# EAGLE design sensor_unitv3 (EAGLE 7.5.0)
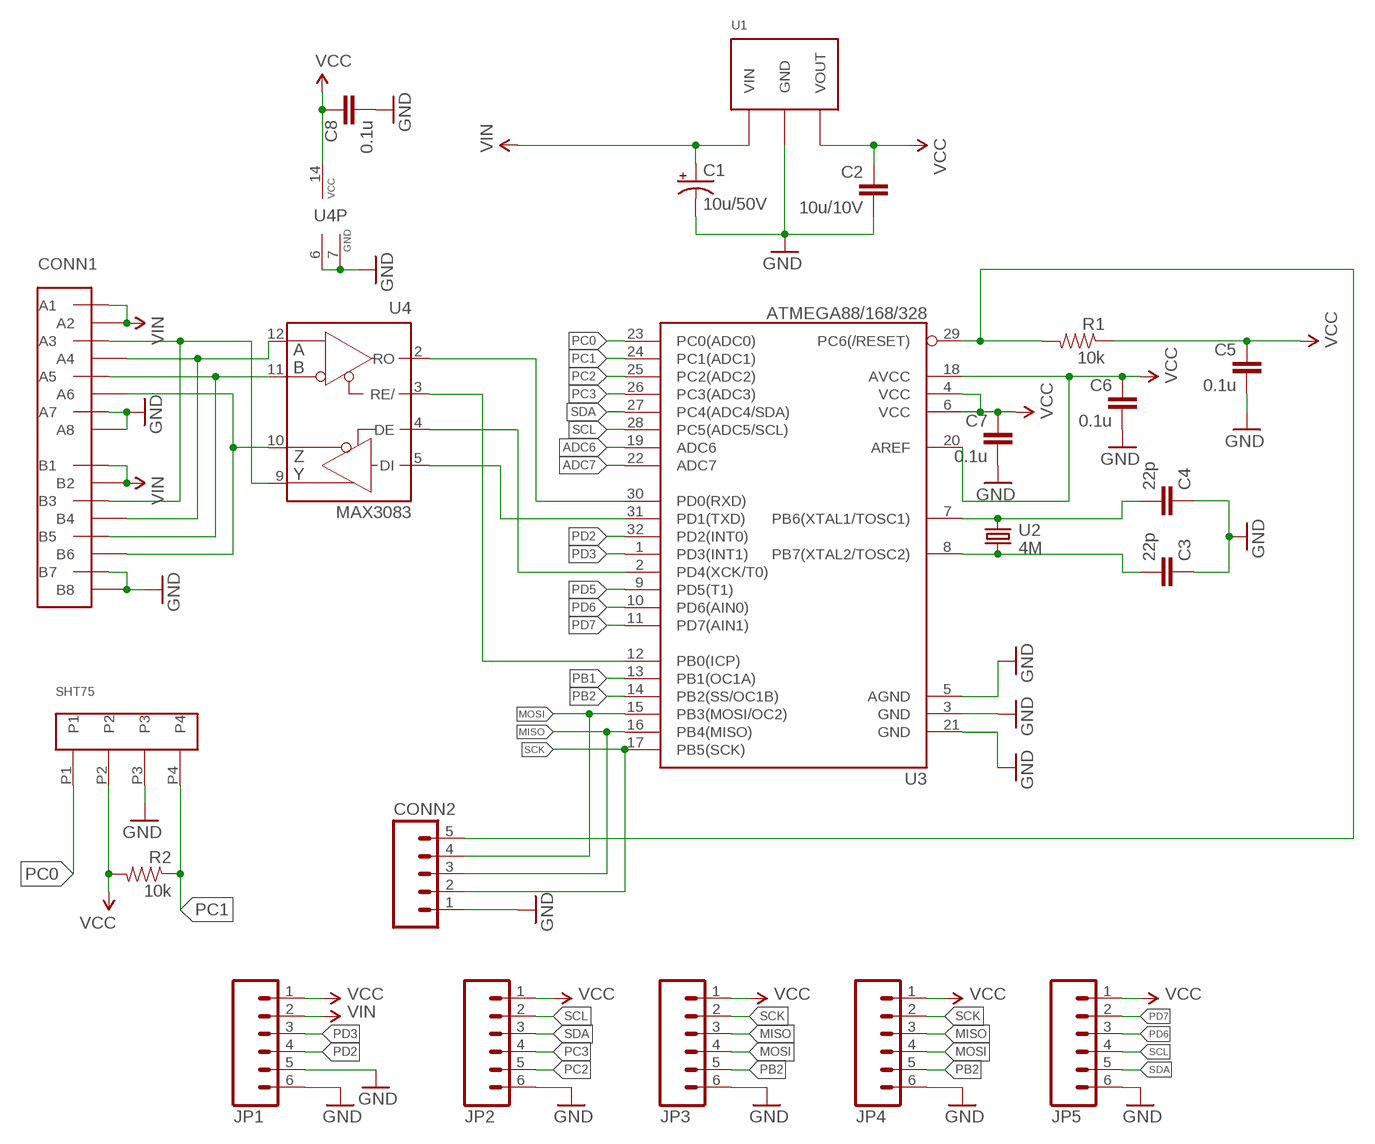
[diagram p0: schematic, sheet 1]

## Parts
C1  10u/50V  CAP_POLC  [PANASONIC_C]
C2  10u/10V  CAP0805  [0805]
C3  22p  CAP0805  [0805]
C4  22p  CAP0805  [0805]
C5  0.1u  CAP0805  [0805]
C6  0.1u  CAP0805  [0805]
C7  0.1u  CAP0805  [0805]
C8  0.1u  CAP0805  [0805]
CONN1  4UCON-04950  [4UCON-04950]
CONN2  M05LOCK  [1X05_LOCK]
JP1  M06LOCK_LONGPADS  [1X06_LOCK_LONGPADS]
JP2  M06LOCK_LONGPADS  [1X06_LOCK_LONGPADS]
JP3  M06LOCK_LONGPADS  [1X06_LOCK_LONGPADS]
JP4  M06LOCK_LONGPADS  [1X06_LOCK_LONGPADS]
JP5  M06LOCK_LONGPADS  [1X06_LOCK_LONGPADS]
R1  10k  RESISTOR0805-RES  [0805]
R2  10k  RESISTOR0805-RES  [0805]
SHT75  MM852-43-004-20  [MM851-43-004-20]
U1  OKI-78SR  [OKI-78SR]
U2  4M  CRYSTALHC49UP  [HC49UP]
U3  ATMEGA88/168/328  ATMEGA168  [TQFP32-08]
U4  MAX3083  MAX489CSD  [SO14]

## Nets
ADC6: U3.19(ADC6)
ADC7: U3.22(ADC7)
C1U49: CONN1.A3 CONN1.B3 U4.9(Y)
DE: U3.2(PD4(XCK/T0)) U4.4(DE)
DI: U3.31(PD1(TXD)) U4.5(DI)
GND: C1.- C2.2 C3.1 C4.1 C5.2 C6.2 C7.2 C8.2 CONN1.A7 CONN1.A8 CONN1.B7 CONN1.B8 CONN2.1 JP1.5 JP1.6 JP2.6 JP3.6 JP4.6 JP5.6 SHT75.P3 U1.GND U3.3(GND) U3.5(AGND) U3.21(GND) U4.6(GND) U4.7(GND)
MISO: CONN2.3 JP3.3 JP4.3 U3.16(PB4(MISO))
MOSI: CONN2.4 JP3.4 JP4.4 U3.15(PB3(MOSI/OC2))
N$3: C3.2 U2.1 U3.8(PB7(XTAL2/TOSC2))
N$4: C4.2 U2.2 U3.7(PB6(XTAL1/TOSC1))
N$12: CONN1.A5 CONN1.B5 U4.11(B)
N$14: CONN1.A4 CONN1.B4 U4.12(A)
N$15: CONN1.A6 CONN1.B6 U4.10(Z)
PB1: U3.13(PB1(OC1A))
PB2: JP3.5 JP4.5 U3.14(PB2(SS/OC1B))
PC0: SHT75.P1 U3.23(PC0(ADC0))
PC1: R2.1 SHT75.P4 U3.24(PC1(ADC1))
PC2: JP2.5 U3.25(PC2(ADC2))
PC3: JP2.4 U3.26(PC3(ADC3))
PD2: JP1.4 U3.32(PD2(INT0))
PD3: JP1.3 U3.1(PD3(INT1))
PD5: U3.9(PD5(T1))
PD6: JP5.3 U3.10(PD6(AIN0))
PD7: JP5.2 U3.11(PD7(AIN1))
RE: U3.12(PB0(ICP)) U4.3(RE/)
RESET: CONN2.5 R1.2 U3.29(PC6(/RESET))
RO: U3.30(PD0(RXD)) U4.2(RO)
SCK: CONN2.2 JP3.2 JP4.2 U3.17(PB5(SCK))
SCL: JP2.2 JP5.4 U3.28(PC5(ADC5/SCL))
SDA: JP2.3 JP5.5 U3.27(PC4(ADC4/SDA))
VCC: C2.1 C5.1 C6.1 C7.1 C8.1 JP1.1 JP2.1 JP3.1 JP4.1 JP5.1 R1.1 R2.2 SHT75.P2 U1.VOUT U3.4(VCC) U3.6(VCC) U3.18(AVCC) U3.20(AREF) U4.14(VCC)
VIN: C1.+ CONN1.A1 CONN1.A2 CONN1.B1 CONN1.B2 JP1.2 U1.VIN
Unconnected: U4.1(NC) U4.8(NC) U4.13(NC)

## Library data of the parts
C1 = SparkFun-Capacitors:CAP_POL: Capacitor Polarized These are standard SMD and PTH capacitors. Normally 10uF, 47uF, and 100uF in electrolytic and tantalum varieties. Always verify the external diameter of the through hole cap, it varies with capacity, voltage, and manufacturer. The EIA devices should be standard.
C2-C8 = SparkFun-Passives:CAP: Capacitor Standard 0603 ceramic capacitor, and 0.1" leaded capacitor.
CONN1 = exoteric-analytics-custom:4UCON-04950
CONN2 = SparkFun:M05: Header 5 Standard 5-pin 0.1" header. Use with straight break away headers (SKU : PRT-00116), right angle break away headers (PRT-00553), swiss pins (PRT-00743), machine pins (PRT-00117), and female headers (PRT-00115). Molex polarized connector foot print use with SKU : PRT-08230 with associated crimp pins and housings.
JP1-JP5 = SparkFun:M06: Header 6 Standard 6-pin 0.1" header. Use with straight break away headers (SKU : PRT-00116), right angle break away headers (PRT-00553), swiss pins (PRT-00743), machine pins (PRT-00117), and female headers (PRT-00115). Molex polarized connector foot print use with SKU : PRT-08094 with associated crimp pins and housings. NOTES ON THE VARIANTS LOCK and LOCK_LONGPADS... This footprint was designed to help hold the alignment of a through-hole component (i.e. 6-pin header) while soldering it into place. You may notice that each hole has been shifted either up or down by 0.005 of an inch from it's more standard position (which is a perfectly straight line). This slight alteration caused the pins (the squares in the middle) to touch the edges of the holes. Because they are alternating, it causes a "brace" to hold the component in place. 0.005 has proven to be the perfect amount of "off-center" position when using our standard breakaway headers. Although looks a little odd when you look at the bare footprint, once you have a header in there, the alteration is very hard to notice. Also, if you push a header all the way into place, it is covered up entirely on the bottom side. This idea of altering the position of holes to aid alignment will be further integrated into the Sparkfun Library for other footprints. It can help hold any component with 3 or more connection pins.
R1 R2 = SparkFun-Passives:RESISTOR: Resistor Basic schematic elements and footprints for 0603, 1206, and PTH resistors.
SHT75 = exoteric-analytics-custom:MM852-43-004-20
U1 = exoteric-analytics-custom:OKI-78SR: DC/DC Converter
U2 = crystal:CRYSTAL: CRYSTAL; OC_FARNELL: unknown; OC_NEWARK: unknown
U3 = SparkFun-DigitalIC:ATMEGA168: Atmel 32-pin 8-bit micro, 16k flash.
U4 = maxim:MAX489CSD: RS485 TRANSEIVER; MF: MAXIM; MPN: MAX489CSD; OC_FARNELL: 9724559; OC_NEWARK: 34C3923

## Board
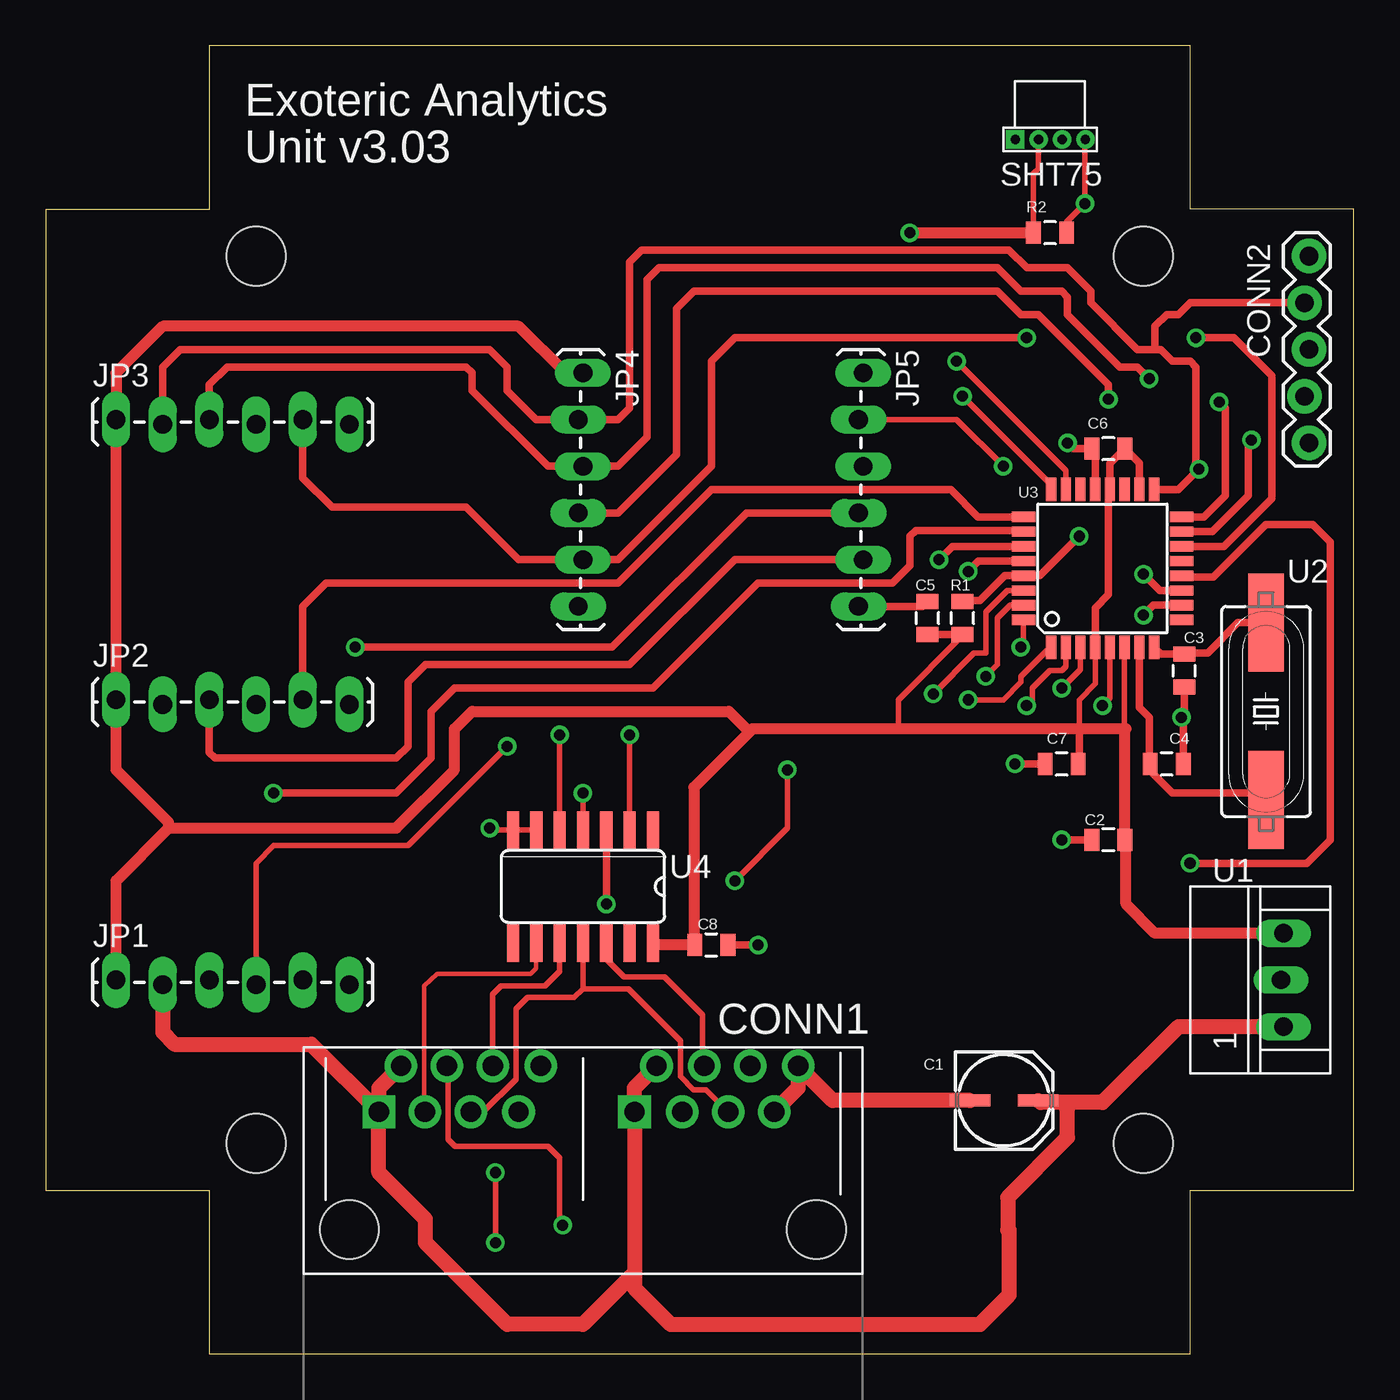
[diagram p1: board, top side]
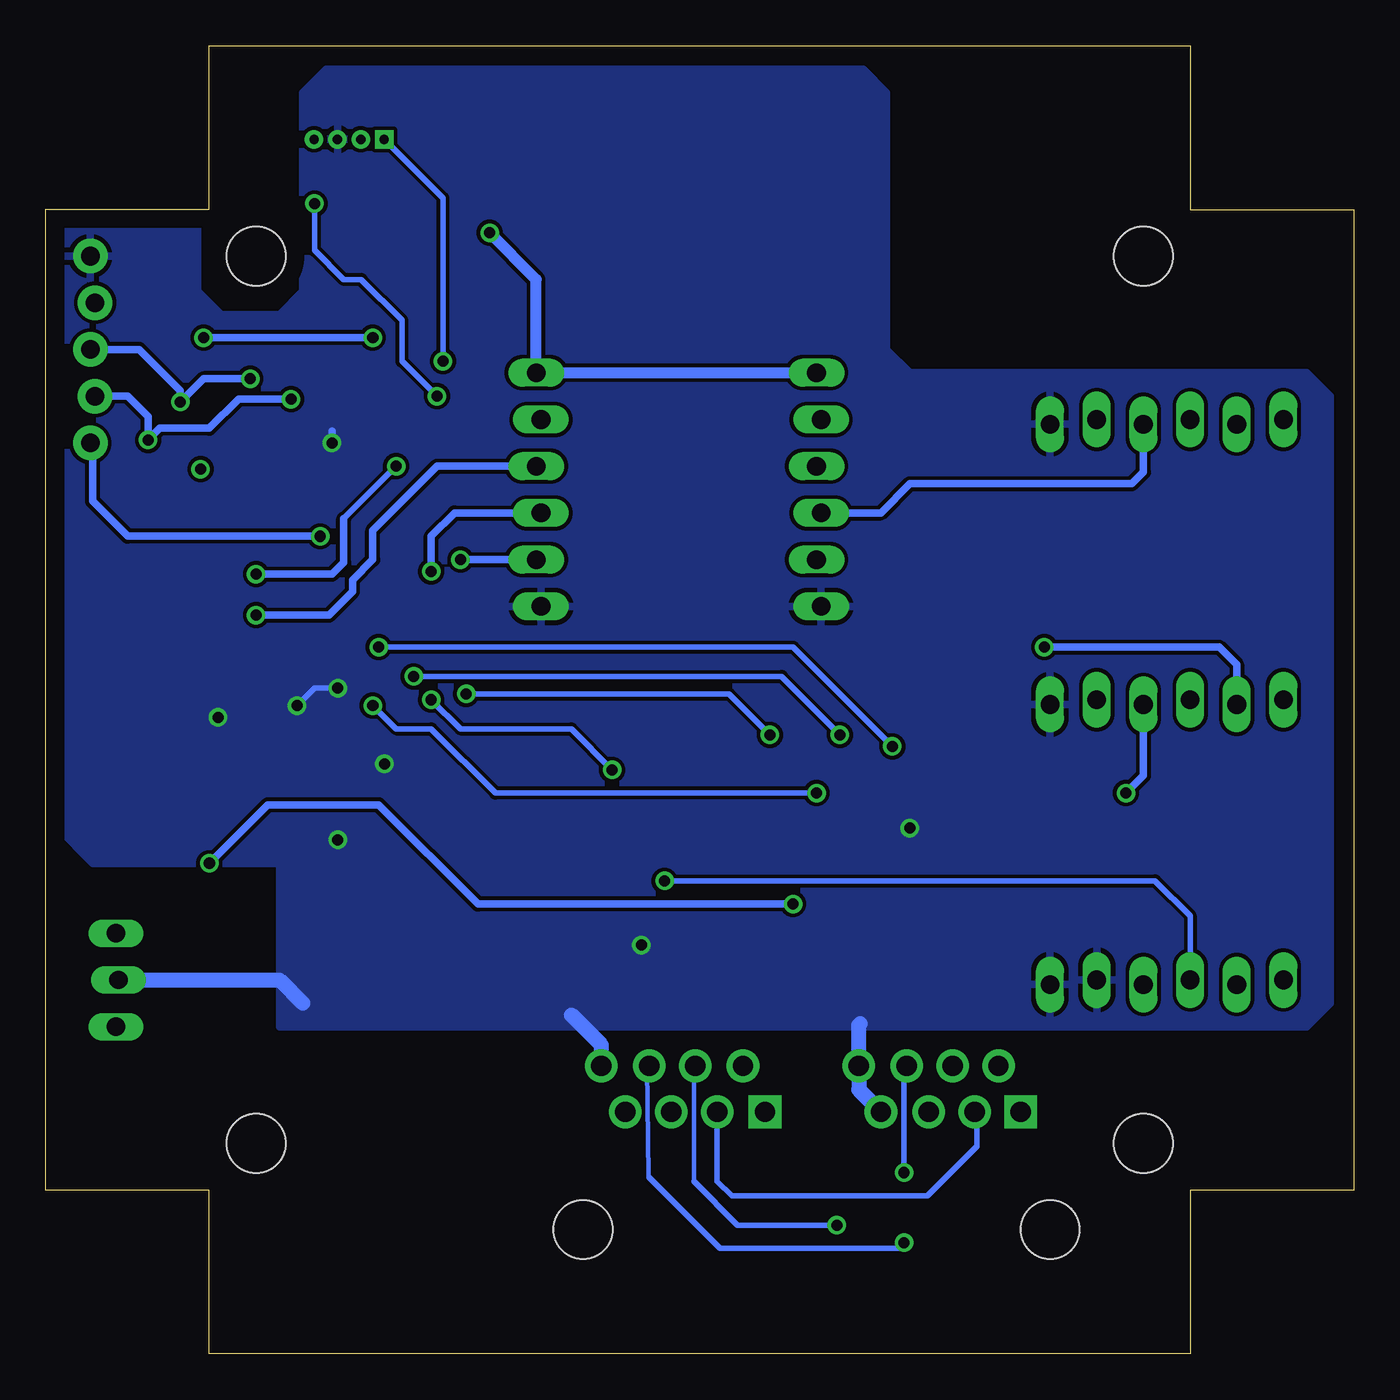
[diagram p2: board, bottom side, seen from below]

Size 71.12 x 71.12 mm. Coordinates in mm from the lower left corner, seen from the top.
Outline: 8.89,8.89 8.89,0 62.23,0 62.23,8.89 71.12,8.89 71.12,62.23 62.23,62.23 62.23,71.12 8.89,71.12 8.89,62.22 0,62.22 0,8.89 8.89,8.89
Copper layers (1*16): Top 0.035mm / dielectric 1.5mm / Bottom 0.035mm
Design rules "default": minimum track width 10mil, minimum drill 13mil, track to track 8mil, track to pad 8mil, pad to pad 8mil, via to via 8mil, smd to smd 8mil, copper to edge 40mil, drill to drill 8mil, minimum pad ring 10mil, minimum via ring 8mil, stop-mask expansion 4mil, vias tented up to drill 0mil, thermal gap 10mil
Holes 3.2 mm at 11.43,11.43 59.69,11.43 59.69,59.69 11.43,59.69

### Footprints (pad centres in the part's own frame; a part is rotated, then mirrored left to right if it is on the bottom)
PANASONIC_C = smd 2.2 x 0.65: + 1.9,-0.2; - -1.8,-0.2
0805 = smd 0.8 x 1.2: 1 -0.9,0; 2 0.9,0
4UCON-04950 = drill 1.1 pad 1.778 square: A1 -11.1,6.8; B1 2.8,6.8 | drill 1.1 pad 1.778: A2 -9.9,9.3; A3 -8.6,6.8; A4 -7.4,9.3; A5 -6.1,6.8; A6 -4.9,9.3; A7 -3.5,6.8; A8 -2.3,9.3; B2 4,9.3; B3 5.4,6.8; B4 6.6,9.3; B5 7.9,6.8; B6 9.1,9.3; B7 10.4,6.8; B8 11.7,9.3 | hole 3.2: -12.7,0.4; 12.7,0.4
1X05_LOCK = drill 1.016 pad 1.88: 1 0,0.127; 2 2.54,-0.127; 3 5.08,0.127; 4 7.62,-0.127; 5 10.16,0.127
1X06_LOCK_LONGPADS = drill 1.016 long: 1 0,0; 2 2.54,-0.254; 3 5.08,0; 4 7.62,-0.254; 5 10.16,0; 6 12.7,-0.254
MM851-43-004-20 = drill 0.5 square: P1 -1.885,0 | drill 0.5: P2 -0.615,0; P3 0.655,0; P4 1.925,0
OKI-78SR = drill 1 long: GND 0,-1.143; VIN -2.54,-1.27; VOUT 2.54,-1.27
HC49UP = smd 5.334 x 1.93: 1 -4.826,0; 2 4.826,0
TQFP32-08 = smd 1.27 x 0.559: 1 -4.293,2.8; 2 -4.293,2; 3 -4.293,1.2; 4 -4.293,0.4; 5 -4.293,-0.4; 6 -4.293,-1.2; 7 -4.293,-2; 8 -4.293,-2.8; 17 4.293,-2.8; 18 4.293,-2; 19 4.293,-1.2; 20 4.293,-0.4; 21 4.293,0.4; 22 4.293,1.2; 23 4.293,2; 24 4.293,2.8 | smd 0.559 x 1.27: 9 -2.8,-4.293; 10 -2,-4.293; 11 -1.2,-4.293; 12 -0.4,-4.293; 13 0.4,-4.293; 14 1.2,-4.293; 15 2,-4.293; 16 2.8,-4.293; 25 2.8,4.293; 26 2,4.293; 27 1.2,4.293; 28 0.4,4.293; 29 -0.4,4.293; 30 -1.2,4.293; 31 -2,4.293; 32 -2.8,4.293
SO14 = smd 0.66 x 2.032: 1 -3.81,-3.073; 2 -2.54,-3.073; 3 -1.27,-3.073; 4 0,-3.073; 5 1.27,-3.073; 6 2.54,-3.073; 7 3.81,-3.073; 8 3.81,3.073; 9 2.54,3.073; 10 1.27,3.073; 11 0,3.073; 12 -1.27,3.073; 13 -2.54,3.073; 14 -3.81,3.073

### Placement (x,y rotation side)
C1  52.07,13.97 0 top
C2  57.78,27.94 180 top
C3  61.91,37.15 90 top
C4  60.96,32.07 180 top
C5  47.94,40.01 90 top
C6  57.78,49.21 180 top
C7  55.24,32.07 180 top
C8  36.2,22.23 0 top
CONN1  29.21,6.35 0 top
CONN2  68.58,59.69 270 top
JP1  3.81,20.32 0 top
JP2  3.81,35.56 0 top
JP3  3.81,50.8 0 top
JP4  29.21,53.34 270 top
JP5  44.45,53.34 270 top
R1  49.85,40.01 90 top
R2  54.61,60.96 180 top
SHT75  54.61,66.04 0 top
U1  66.04,20.32 90 top
U2  66.36,34.92 270 top
U3  57.47,42.7 90 top
U4  29.21,25.4 180 top

### Tracks (layer width: path | path; a pad name or v marks a point on that pad's centre or on a via)
C1U49
  Top 0.254: U4.9 26.67,20.95 26.35,20.64 21.27,20.64 20.56,20 20.56,13.2 CONN1.A3
  Bottom 0.305: CONN1.B3 34.61,9.37 33.81,8.57 23.18,8.57 20.48,11.27 20.48,13.02 CONN1.A3
DE  (via drill 0.6)
  Top 0.305: U4.4 v29.21,30.48 | U3.2 55.47,37.37 55.24,37.15 54.61,37.15 53.66,36.2 53.66,35.56 v53.34,35.24
  Bottom 0.305: v53.34,35.24 52.07,33.97 50.16,33.97 46.67,30.48 v29.21,30.48
DI  (via drill 0.6)
  Top 0.305: U3.31 52.45,40.7 51.75,40.01 51.75,37.47 v51.12,36.83 | v27.94,33.66 U4.5
  Bottom 0.305: v51.12,36.83 31.11,36.83 v27.94,33.66
GND  (via drill 0.6)
  Top 0.305: U3.5 57.87,35.64 v57.47,35.24 | U3.3 56.27,37.22 v55.24,36.2 | U4.6 U4.7 24.23,28.47 v24.13,28.57
  Top 0.406: JP5.6 47.68,40.64 C5.2 | v55.56,49.53 55.88,49.21 C6.2 57.07,49.03 U3.21 | C8.2 v38.73,22.23 | C2.2 v55.24,27.94 | C7.2 v52.7,32.07 | C3.1 61.91,34.77 v61.75,34.61 61.86,34.5 C4.1
  Top 0.813: C1.- 42.79,13.77 CONN1.B8 40.91,14.45 CONN1.B7
  Bottom 0.305: 57.15,35.24 v57.47,35.24 56.52,36.2 v55.24,36.2 | v24.13,28.57 23.81,28.57
  Bottom 0.406: v55.56,49.53 55.56,50.16 | v38.73,22.23 39.05,22.23
  Bottom 0.813: U1.GND 58.42,20.32 57.15,19.05 | CONN1.B8 40.91,16.78 42.55,18.41 | CONN1.A7 26.91,14.35 CONN1.A8 26.91,17.86 26.83,17.94
  pour Bottom: 2.54,17.78 58.42,17.78 58.42,26.67 68.58,26.67 70.48,28.57 70.48,61.59 62.87,61.59 62.87,57.78 61.59,56.52 58.42,56.52 57.15,57.78 57.15,68.58 55.88,69.85 26.67,69.85 25.4,68.58 25.4,54.61 24.13,53.34 2.54,53.34 1.27,52.07 1.27,19.05
MISO  (via drill 0.6)
  Top 0.406: 59.69,53.34 v60.01,53.02 59.37,53.66 58.42,53.66 55.56,56.52 55.56,57.47 55.24,57.78 53.02,57.78 51.75,59.05 33.34,59.05 32.7,58.42 32.7,49.85 31.11,48.26 JP4.3 27.3,48.26 23.18,52.39 23.18,53.34 22.86,53.66 9.84,53.66 8.89,52.7 JP3.3 | U3.16 62.97,45.5 64.14,46.67 64.14,51.44 v63.82,51.75
  Bottom 0.406: v60.01,53.02 62.55,53.02 v63.82,51.75 63.82,52.39 66.04,54.61 CONN2.3
MOSI  (via drill 0.6)
  Top 0.406: JP4.4 31.11,45.72 34.29,48.9 34.29,56.83 35.24,57.78 51.75,57.78 53.02,56.52 53.98,56.52 57.78,52.7 v57.78,51.91 | U3.15 63.44,44.7 65.41,46.67 65.41,49.53 v65.56,49.69
  Bottom 0.406: v57.78,51.91 60.64,51.91 62.23,50.32 64.93,50.32 v65.56,49.69 65.56,50.96 66.67,52.07 CONN2.4 | JP4.4 25.72,45.72 24.13,47.31 12.06,47.31 11.43,47.94 JP3.4
N$3
  Top 0.406: 66.61,40.32 U2.1 64.83,39.75 63.18,38.1 61.97,38.1 C3.2 60.63,38.05 U3.8
N$4
  Top 0.406: U3.7 59.47,35.15 60.01,34.61 60.01,32.12 C4.2 60.06,31.7 61.28,30.48 65.98,30.48 U2.2 66.47,30.53
N$12
  Top 0.305: CONN1.A5 23.79,13.15 25.56,14.92 25.56,18.73 26.19,19.37 28.73,19.37 29.21,19.84 | 29.21,19.84 U4.11 | 29.21,19.84 31.69,19.84 34.52,17.02 34.52,15.06 35.23,14.35 35.91,14.35 CONN1.B5
N$14  (via drill 0.6)
  Top 0.305: U4.12 30.48,21.43 31.43,20.48 33.66,20.48 35.72,18.41 35.72,15.74 CONN1.B4 | v28.1,6.99 27.94,7.14 27.94,10.64 27.3,11.27 22.26,11.27 21.87,11.66 21.87,15.59 CONN1.A4
  Bottom 0.254: 35.88,15.58 35.88,9.37
  Bottom 0.305: v28.1,6.99 33.5,6.99 35.88,9.37 | 35.88,15.58 CONN1.B4
N$15  (via drill 0.6)
  Top 0.305: U4.10 27.94,20.8 27.15,20 24.77,20 24.29,19.53 24.29,15.67 CONN1.A6 | v24.45,9.84 v24.45,6.03
  Bottom 0.254: 38.31,9.58 38.34,9.68 38.42,15.54 CONN1.B6
  Bottom 0.305: 38.31,9.58 34.45,5.71 24.61,5.71 v24.45,6.03 | CONN1.A6 24.29,15.63 24.45,15.63 v24.45,9.84
PB2  (via drill 0.6)
  Top 0.406: v62.55,55.24 64.61,55.24 66.67,53.18 66.67,46.51 64.06,43.9 U3.14 | JP3.5 13.97,47.62 15.56,46.04 22.86,46.04 25.72,43.18 JP4.5 31.11,43.18 36.2,48.26 36.2,53.98 37.47,55.24 v53.34,55.24
  Bottom 0.406: v53.34,55.24 v62.55,55.24
PC0  (via drill 0.6)
  Top 0.305: U3.23 55.47,48.04 v49.53,53.98
  Bottom 0.305: v49.53,53.98 49.53,62.84 SHT75.P1
PC1  (via drill 0.6)
  Top 0.305: U3.24 54.67,47.25 v49.85,52.07 | SHT75.P4 56.52,66.02 v56.52,62.55 55.51,61.54 R2.1
  Bottom 0.305: v49.85,52.07 51.75,53.98 51.75,56.2 53.98,58.42 54.93,58.42 56.52,60.01 v56.52,62.55
PC2
  Top 0.406: U3.25 50.7,45.5 49.21,46.99 36.2,46.99 31.11,41.91 15.24,41.91 13.97,40.64 JP2.5
PC3  (via drill 0.6)
  Top 0.406: v12.38,30.48 19.05,30.48 20.95,32.38 20.95,34.92 22.23,36.2 33.02,36.2 38.73,41.91 46.04,41.91 46.99,42.86 46.99,44.45 47.31,44.77 53.11,44.77 U3.26
  Bottom 0.406: JP2.4 11.43,31.43 v12.38,30.48
PD2  (via drill 0.6)
  Top 0.305: U3.32 53.17,38.57 v53.02,38.42 | v25.08,33.02 19.68,27.62 12.38,27.62 11.43,26.67 JP1.4
  Bottom 0.305: v53.02,38.42 30.48,38.42 v25.08,33.02
PD3  (via drill 0.6)
  Top 0.305: U3.1 54.6,38.41 53.02,36.83 53.02,36.51 52.07,35.56 v50.16,35.56 | v40.32,31.75 40.32,28.57 v37.47,25.72
  Bottom 0.305: v50.16,35.56 48.58,33.97 42.55,33.97 v40.32,31.75 | v37.47,25.72 10.79,25.72 8.89,23.81 JP1.3
PD6  (via drill 0.6)
  Top 0.406: U3.10 60.23,40.7 v59.69,40.16
  Bottom 0.406: v59.69,40.16 55.72,40.16 54.45,41.43 54.45,42.07 53.34,43.18 53.34,44.77 49.85,48.26 JP5.3
PD7  (via drill 0.6)
  Top 0.305: v52.07,48.26 49.53,50.8 JP5.2
  Top 0.406: U3.11 60.57,41.5 v59.69,42.39
  Bottom 0.305: 54.93,45.4 v52.07,48.26
  Bottom 0.406: v59.69,42.39 55.56,42.39 54.93,43.02 54.93,45.4
RE  (via drill 0.6)
  Top 0.406: U4.3 v30.48,24.45 | v62.23,26.67 68.58,26.67 69.85,27.94 69.85,44.13 68.9,45.09 66.36,45.09 63.5,42.23 61.84,42.23 U3.12
  Bottom 0.406: v30.48,24.45 47.62,24.45 53.02,29.84 59.05,29.84 v62.23,26.67
RESET  (via drill 0.6)
  Top 0.406: R1.2 49.9,40.96 50.8,40.96 52.15,42.3 U3.29 54.05,42.3 v56.2,44.45
  Bottom 0.406: v56.2,44.45 66.67,44.45 68.58,46.35 68.58,49.4 CONN2.5
RO  (via drill 0.6)
  Top 0.305: U3.30 52.3,41.5 51.12,40.32 51.12,38.1 50.48,38.1 v48.26,35.88 | v31.75,33.66 U4.2
  Bottom 0.305: v48.26,35.88 33.97,35.88 v31.75,33.66
SCK  (via drill 0.6)
  Top 0.406: U3.17 61.6,47 v62.71,48.1 62.55,48.26 62.55,53.66 62.23,53.98 61.28,53.98 60.64,54.61 60.33,54.61 | JP3.2 6.35,53.66 7.3,54.61 24.13,54.61 25.08,53.66 25.08,52.39 26.67,50.8 JP4.2 31.11,50.8 31.75,51.44 31.75,59.37 32.38,60.01 52.39,60.01 53.34,59.05 55.56,59.05 56.83,57.78 56.83,57.15 59.37,54.61 60.33,54.61 | CONN2.2 62.23,57.15 61.59,56.52 60.96,56.52 60.33,55.88 60.33,54.61
SCL  (via drill 0.6)
  Top 0.406: JP5.4 38.1,45.72 30.8,38.42 v16.83,38.42 | U3.28 50.72,43.1 v50.16,42.55
  Bottom 0.406: v16.83,38.42 7.3,38.42 6.35,37.47 JP2.2 | v50.16,42.55 50.16,44.45 48.9,45.72 JP5.4
SDA  (via drill 0.6)
  Top 0.406: JP5.5 37.47,43.18 31.75,37.47 20.64,37.47 19.68,36.51 19.68,33.02 19.05,32.38 9.21,32.38 8.89,32.7 JP2.3 | U3.27 49.3,43.9 v48.58,43.18
  Bottom 0.406: v48.58,43.18 JP5.5
VCC  (via drill 0.6)
  Top 0.305: R2.2 53.71,64.19 53.98,64.45 53.98,66.02 SHT75.P2 | U3.4 57.07,36.43 56.2,35.56 56.2,33.97 | R1.1 49.85,39.05 46.35,35.56 46.35,33.97 | 58.79,33.92 58.74,33.97 58.67,34.04 U3.6
  Top 0.406: C5.1 R1.1 | U3.4 57.07,40.56 57.78,41.27 57.78,46.91 U3.20 57.87,48.4 C6.1 59.47,48.43 U3.18 | 56.2,33.97 56.2,32.12 C7.1
  Top 0.61: 38.26,33.81 38.42,33.97 46.35,33.97 56.2,33.97 58.74,33.97 58.69,33.92 C2.1 58.74,27.89 58.74,24.45 60.33,22.86 U1.VOUT | 38.26,33.81 35.24,30.8 35.24,22.28 C8.1 33.12,22.23 U4.14 | JP1.1 3.81,25.72 6.67,28.57 | 6.67,28.57 19.05,28.57 22.23,31.75 22.23,33.97 23.18,34.92 37.15,34.92 38.26,33.81 | 6.67,28.57 6.67,28.89 3.81,31.75 JP2.1 JP3.1 3.81,53.34 6.35,55.88 25.72,55.88 28.26,53.34 JP4.1 | v46.99,60.96 R2.2
  Bottom 0.61: JP4.1 JP5.1 44.45,58.42 v46.99,60.96
VIN
  Top 0.813: JP1.2 6.35,17.46 6.99,16.83 14.43,16.83 CONN1.A1 | CONN1.A1 18.11,14.45 CONN1.A2 | CONN1.B1 32.01,3.55 33.97,1.59 50.8,1.59 52.39,3.17 52.39,6.72 52.31,6.72 52.31,8.49 55.56,11.75 55.56,13.34 55.24,13.65 | CONN1.B1 32.01,4.39 29.21,1.59 25.08,1.59 20.64,6.03 20.64,7.3 18.1,9.84 18.1,13.14 CONN1.A1 | CONN1.B1 32.01,14.45 CONN1.B2 | U1.VIN 61.59,17.78 57.47,13.65 55.24,13.65 | 55.24,13.65 54.09,13.65 C1.+

### Text on the board
tPlace: Exoteric Analytics | Unit v3.03